# EasyEDA Pro project Pros_touch_weight_sensor-v1.0.0-2023-4-8.eprj, board PWS1
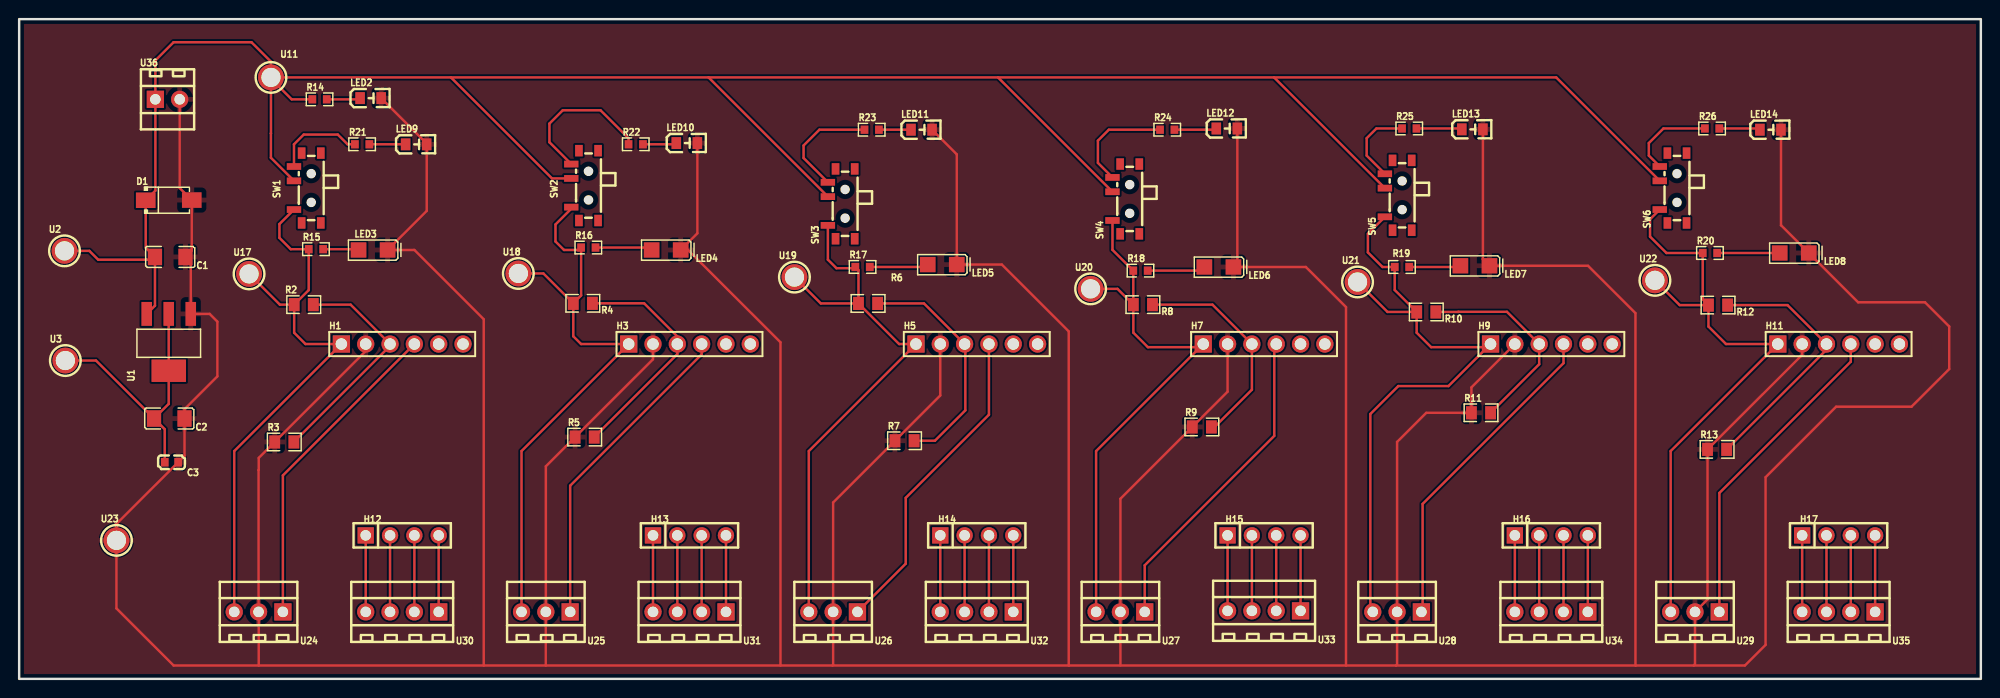
[diagram p1: board, top side]
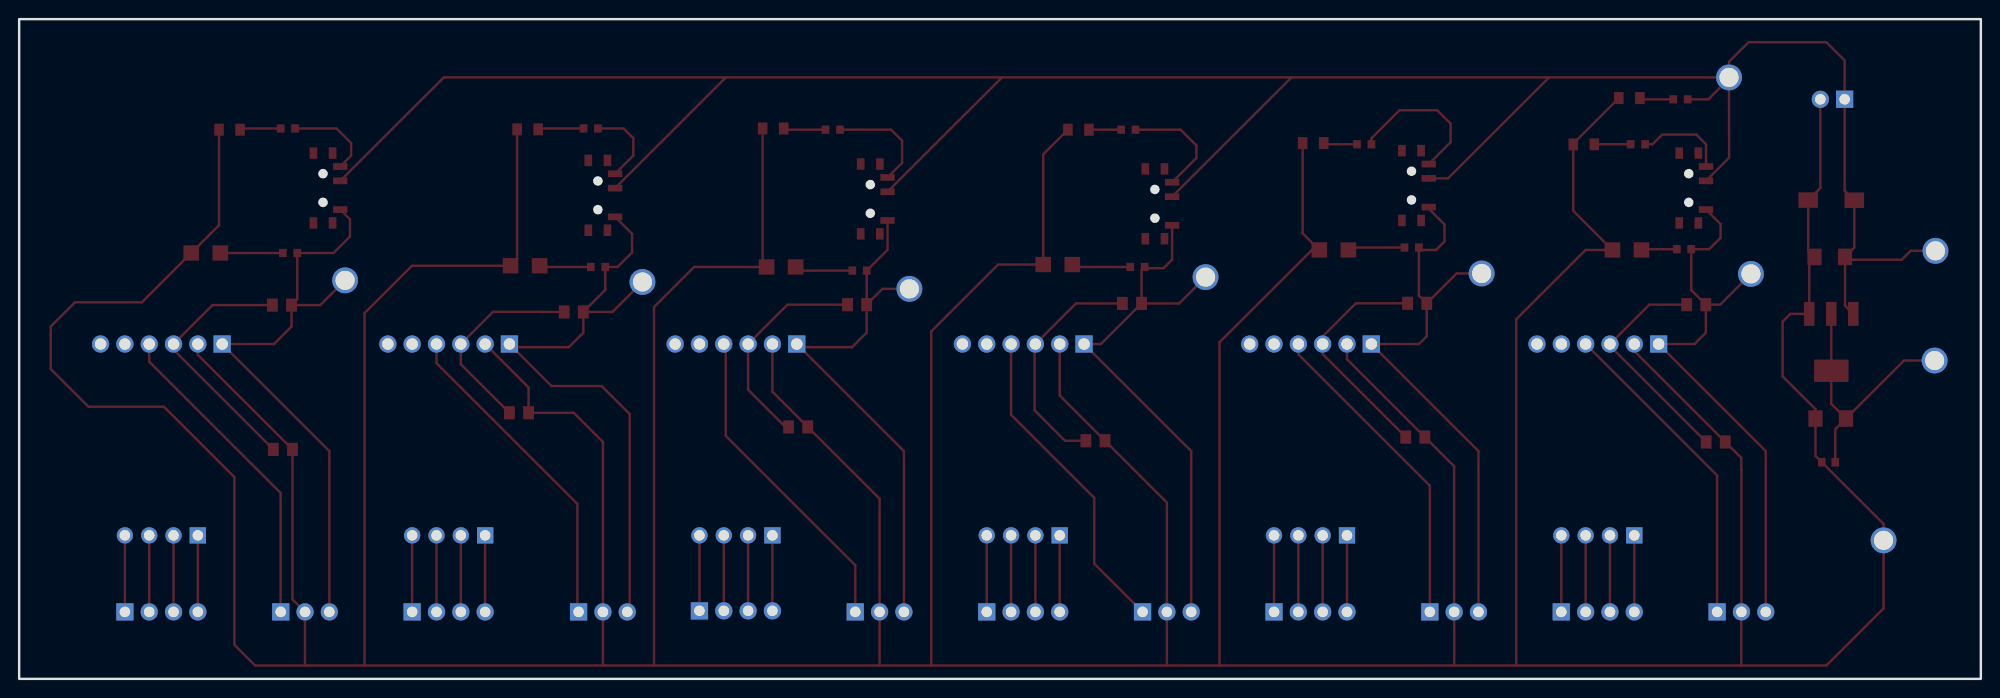
[diagram p2: board, bottom side, seen from below]

Outline 204.85 x 68.96 mm; copper layers: Top Layer, Bottom Layer. Coordinates in mm from the lower left corner of the outline.
Outline path: rectangle 0,68.96 204.85,0
Stack: Top Layer 0.035mm / Dielectric1 1.51mm FR4 er 4.5 / Bottom Layer 0.035mm

## Design rules (mm)
template: JLCPCB Capability(Two Layers Board)
spacing copperThickness1oz (default): track to track 0.102, other pairs 0.152 to 0.3
spacing copperThickness2oz: track to track 0.203, other pairs 0.152 to 0.3
track width copperThickness1oz (default): min 0.127, default 0.254, max 2.54
track width copperThickness2oz: min 0.203, default 0.254, max 2.54
differential pair differentialPair (default): width min 0.127, default 0.254, max 2.54; gap min 0.152, default 0.152
via viaSize (default): diameter min 0.5, default 0.61, max 10; hole min 0.3, default 0.305, max 6.3

## Placement (name value [footprint] x y rotation side)
C1  47uF  [C1206]  15.78 44.11 180 top
C2  47uF  [C1206]  15.68 27.21 180 top
C3  100nF  [C0603]  15.9 22.64 180 top
D1  SMAJ5.0A  [SMA_L4.3-W2.6-LS5.0-RD]  15.62 50.04 0 top
H1  2.54-1x6P直针  [HDR-TH_6P-P2.54-V-M-1]  40 35 0 top
H3  2.54-1x6P直针  [HDR-TH_6P-P2.54-V-M-1]  70 35 0 top
H5  2.54-1x6P直针  [HDR-TH_6P-P2.54-V-M-1]  100 35 0 top
H7  2.54-1x6P直针  [HDR-TH_6P-P2.54-V-M-1]  130 35 0 top
H9  2.54-1x6P直针  [HDR-TH_6P-P2.54-V-M-1]  160 35 0 top
H11  2.54-1x6P直针  [HDR-TH_6P-P2.54-V-M-1]  190 35 0 top
H12  B-2100S04P-A110  [HDR-TH_4P-P2.54-V-M]  40 15 0 top
H13  B-2100S04P-A110  [HDR-TH_4P-P2.54-V-M]  70 15 0 top
H14  B-2100S04P-A110  [HDR-TH_4P-P2.54-V-M]  100 15 0 top
H15  B-2100S04P-A110  [HDR-TH_4P-P2.54-V-M]  130 15 0 top
H16  B-2100S04P-A110  [HDR-TH_4P-P2.54-V-M]  160 15 0 top
H17  B-2100S04P-A110  [HDR-TH_4P-P2.54-V-M]  190 15 0 top
LED2  NCD0805B2  [LED0805-RD]  36.7 60.71 0 top
LED3  NCD1206G1  [LED1206-RD]  36.96 44.83 180 top
LED4  NCD1206G1  [LED1206-RD]  67.56 44.83 180 top
LED5  NCD1206G1  [LED1206-RD]  96.39 43.31 180 top
LED6  NCD1206G1  [LED1206-RD]  125.28 43.05 180 top
LED7  NCD1206G1  [LED1206-RD]  152.02 43.18 180 top
LED8  NCD1206G1  [LED1206-RD]  185.36 44.52 180 top
LED9  NCD0805B2  [LED0805-RD]  41.46 55.87 0 top
LED10  NCD0805B2  [LED0805-RD]  69.72 56.01 0 top
LED11  NCD0805B2  [LED0805-RD]  94.23 57.4 0 top
LED12  NCD0805B2  [LED0805-RD]  126.11 57.53 0 top
LED13  NCD0805B2  [LED0805-RD]  151.75 57.44 0 top
LED14  NCD0805B2  [LED0805-RD]  182.88 57.4 0 top
R2  1kΩ  [R0805]  29.72 39.12 180 top
R3  1kΩ  [R0805]  27.69 24.77 0 top
R4  1kΩ  [R0805]  58.86 39.26 180 top
R5  1kΩ  [R0805]  59.06 25.27 0 top
R6  1kΩ  [R0805]  88.65 39.24 180 top
R7  1kΩ  [R0805]  92.46 24.89 0 top
R8  1kΩ  [R0805]  117.35 39.12 180 top
R9  1kΩ  [R0805]  123.51 26.33 0 top
R10  1kΩ  [R0805]  146.94 38.35 180 top
R11  1kΩ  [R0805]  152.65 27.81 0 top
R12  1kΩ  [R0805]  177.41 39.07 180 top
R13  1kΩ  [R0805]  177.31 23.99 0 top
R14  1kΩ  [R0603]  31.37 60.58 0 top
R15  1kΩ  [R0603]  30.99 44.91 0 top
R16  1kΩ  [R0603]  59.44 45.08 0 top
R17  1kΩ  [R0603]  88.07 43.05 0 top
R18  1kΩ  [R0603]  117.09 42.67 0 top
R19  1kΩ  [R0603]  144.4 43.05 0 top
R20  1kΩ  [R0603]  176.56 44.52 0 top
R21  1kΩ  [R0603]  35.81 55.88 0 top
R22  1kΩ  [R0603]  64.39 55.88 0 top
R23  1kΩ  [R0603]  89.03 57.4 0 top
R24  1kΩ  [R0603]  119.89 57.4 0 top
R25  1kΩ  [R0603]  145.16 57.53 0 top
R26  1kΩ  [R0603]  176.78 57.53 0 top
SW1  PCM12SMTR  [SW-SMD_PCM12SMTR]  30.1 51.31 90 top
SW2  PCM12SMTR  [SW-SMD_PCM12SMTR]  59.06 51.56 90 top
SW3  PCM12SMTR  [SW-SMD_PCM12SMTR]  85.85 49.66 90 top
SW4  PCM12SMTR  [SW-SMD_PCM12SMTR]  115.57 50.17 90 top
SW5  PCM12SMTR  [SW-SMD_PCM12SMTR]  144.02 50.55 90 top
SW6  PCM12SMTR  [SW-SMD_PCM12SMTR]  172.72 51.31 90 top
U1  AMS1117-3.3  [SOT-223-3_L6.5-W3.4-P2.30-LS7.0-BR]  15.62 35.18 90 top
U2  5010  [TESTPOINT-TH_BD3.2]  4.74 44.74 0 top
U3  5010  [TESTPOINT-TH_BD3.2]  4.83 33.27 0 top
U11  5010  [TESTPOINT-TH_BD3.2]  26.3 62.87 0 top
U17  5010  [TESTPOINT-TH_BD3.2]  24.01 42.33 0 top
U18  5010  [TESTPOINT-TH_BD3.2]  52.13 42.38 0 top
U19  5010  [TESTPOINT-TH_BD3.2]  80.96 42 0 top
U20  5010  [TESTPOINT-TH_BD3.2]  111.89 40.77 0 top
U21  5010  [TESTPOINT-TH_BD3.2]  139.76 41.49 0 top
U22  5010  [TESTPOINT-TH_BD3.2]  170.81 41.66 0 top
U23  5010  [TESTPOINT-TH_BD3.2]  10.16 14.48 0 top
U24  DB125-2.54-3P-GN-S  [CONN-TH_DB125-2.54-3P-GN]  25 7 180 top
U25  DB125-2.54-3P-GN-S  [CONN-TH_DB125-2.54-3P-GN]  55 7 180 top
U26  DB125-2.54-3P-GN-S  [CONN-TH_DB125-2.54-3P-GN]  85 7 180 top
U27  DB125-2.54-3P-GN-S  [CONN-TH_DB125-2.54-3P-GN]  115 7 180 top
U28  DB125-2.54-3P-GN-S  [CONN-TH_DB125-2.54-3P-GN]  143.89 7 180 top
U29  DB125-2.54-3P-GN-S  [CONN-TH_DB125-2.54-3P-GN]  175 7 180 top
U30  DB125-2.54-4P-GN-S  [CONN-TH_DB125-2.54-4P-GN]  40 7 180 top
U31  DB125-2.54-4P-GN-S  [CONN-TH_DB125-2.54-4P-GN]  70 7 180 top
U32  DB125-2.54-4P-GN-S  [CONN-TH_DB125-2.54-4P-GN]  100 7 180 top
U33  DB125-2.54-4P-GN-S  [CONN-TH_DB125-2.54-4P-GN]  130 7.11 180 top
U34  DB125-2.54-4P-GN-S  [CONN-TH_DB125-2.54-4P-GN]  160 7 180 top
U35  DB125-2.54-4P-GN-S  [CONN-TH_DB125-2.54-4P-GN]  190 7 180 top
U36  DB125-2.54-2P-GN-S  [CONN-TH_DB125-2.54-2P-GN]  15.49 60.58 0 top

## Footprints (pads in the part's own frame, mm; a bottom-side part is the same pattern mirrored in y, then rotated)
C0603
  rect 0.8x0.9 smd: 1(-0.7,0) 2(0.7,0)
C1206
  rect 1.485x1.728 smd: 1(-1.593,0) 2(1.593,0)
CONN-TH_DB125-2.54-2P-GN
  rect 1.8x1.8 hole 1.1: 1(-1.27,0)
  round 1.8 hole 1.1: 2(1.27,0)
CONN-TH_DB125-2.54-3P-GN
  rect 1.8x1.8 hole 1.1: 1(-2.54,0)
  round 1.8 hole 1.1: 2(0,0) 3(2.54,0)
CONN-TH_DB125-2.54-4P-GN
  rect 1.8x1.8 hole 1.1: 1(-3.81,0)
  round 1.8 hole 1.1: 2(-1.27,0) 3(1.27,0) 4(3.81,0)
HDR-TH_4P-P2.54-V-M
  rect 1.7x1.7 hole 1.1: 1(-3.81,0)
  round 1.7 hole 1.1: 2(-1.27,0) 3(1.27,0) 4(3.81,0)
HDR-TH_6P-P2.54-V-M-1
  rect 1.8x1.8 hole 1.2: 1(-6.35,0)
  round 1.8 hole 1.2: 2(-3.81,0) 3(-1.27,0) 4(1.27,0) 5(3.81,0) 6(6.35,0)
LED0805-RD
  rect 1x1.25 smd: 1(-1.1,0) 2(1.1,0)
LED1206-RD
  rect 1.635x1.6 smd: 1(-1.518,0) 2(1.518,0)
R0603
  rect 0.806x0.864 smd: 1(-0.753,0) 2(0.753,0)
R0805
  rect 1.133x1.377 smd: 1(-1,0) 2(1,0)
SMA_L4.3-W2.6-LS5.0-RD
  rect 2.046x1.62 smd: 1(-2.404,-0.009) 2(2.404,0.009)
SOT-223-3_L6.5-W3.4-P2.30-LS7.0-BR
  rect 2.5x1.1 smd: 1(2.97,-2.3) 2(2.97,0) 3(2.97,2.3)
  rect 2.34x3.6 smd: 4(-2.97,0)
SW-SMD_PCM12SMTR
  rect 0.7x1.5 smd: 1(-2.25,1.4) 2(0.75,1.4) 3(2.25,1.4)
  rect 1.2x0.8 smd: 4(-3.65,0.6) 4(-3.65,-1.4) 4(3.65,0.6) 4(3.65,-1.4)
TESTPOINT-TH_BD3.2
  round 2.7 hole 2: 1(0,0)

## Nets
3.3V: C2.2 C3.2 U1.2 U1.4 U3.1
5V: C1.2 D1.1 R14.1 SW1.2 SW2.2 SW3.2 SW4.2 SW5.2 SW6.2 U1.3 U2.1 U11.1 U36.1
GND: C1.1 C2.1 C3.1 D1.2 H1.2 H3.2 H5.2 H7.2 H9.2 H11.2 LED2.2 LED3.1 LED4.1 LED5.1 LED6.1 LED7.1 LED8.1 LED9.2 LED10.2 LED11.2 LED12.2 LED13.2 LED14.2 R3.1 R5.1 R7.1 R9.1 R11.1 R13.1 U1.1 U23.1 U24.2 U25.2 U26.2 U27.2 U28.2 U29.2 U36.2
GND1: H12.4 U30.1
VCC1: H12.1 U30.4
A1+: H1.4 U24.1
A1-: H1.3 R2.1 R3.2
A2+: H3.4 U25.1
A2-: H3.3 R4.1 R5.2
A3+: H5.4 U26.1
A3-: H5.3 R6.1 R7.2
A4+: H7.4 U27.1
A4-: H7.3 R8.1 R9.2
A5+: H9.4 U28.1
A5-: H9.3 R10.1 R11.2
A6+: H11.4 U29.1
A6-: H11.3 R12.1 R13.2
DT: H12.3 U30.2
E1+: H1.1 R2.2 R15.1 SW1.1 U17.1 U24.3
E2+: H3.1 R4.2 R16.1 SW2.1 U18.1 U25.3
E3+: H5.1 R6.2 R17.1 SW3.1 U19.1 U26.3
E4+: H7.1 R8.2 R18.1 SW4.1 U20.1 U27.3
E5+: H9.1 R10.2 R19.1 SW5.1 U21.1 U28.3
E6+: H11.1 R12.2 R20.1 SW6.1 U22.1 U29.3
SCK: H12.2 U30.3
$1N6996: LED2.1 R14.2
$1N8070: LED3.2 R15.2
$1N8106: LED4.2 R16.2
$1N8147: LED5.2 R17.2
$1N8185: LED6.2 R18.2
$1N8223: LED7.2 R19.2
$1N8261: LED8.2 R20.2
$1N8907: LED9.1 R21.2
$1N8986: LED10.1 R22.2
$1N9065: LED11.1 R23.2
$1N9144: LED12.1 R24.2
$1N9223: LED13.1 R25.2
$1N9302: LED14.1 R26.2
$1N9310: R21.1 SW1.3
$1N9314: R22.1 SW2.3
$1N9318: R23.1 SW3.3
$1N9322: R24.1 SW4.3
$1N9326: R25.1 SW5.3
$1N9330: R26.1 SW6.3
$1N10322: H13.1 U31.4
$1N10325: H13.2 U31.3
$1N10328: H13.3 U31.2
$1N10331: H13.4 U31.1
$1N10334: H14.1 U32.4
$1N10337: H14.2 U32.3
$1N10340: H14.3 U32.2
$1N10343: H14.4 U32.1
$1N10346: H15.1 U33.4
$1N10349: H15.2 U33.3
$1N10352: H15.3 U33.2
$1N10355: H15.4 U33.1
$1N10358: H16.1 U34.4
$1N10378: H16.2 U34.3
$1N10381: H16.3 U34.2
$1N10384: H16.4 U34.1
$1N10387: H17.1 U35.4
$1N10390: H17.2 U35.3
$1N10393: H17.3 U35.2
$1N10396: H17.4 U35.1

Pads without a net: H1 5 6; H3 5 6; H5 5 6; H7 5 6; H9 5 6; H11 5 6; SW1 4; SW2 4; SW3 4; SW4 4; SW5 4; SW6 4

## Routing (per net, layer and track width the routed paths; a pad name or vN(x,y) marks a point on that pad's centre or on a via; arc(x,y) is an arc through that point)
3.3V: length 28.4
  Top Layer w0.254: C2.2 8.02,33.27 U3.1 ; C2.2 15.62,28.75 U1.4 U1.2 ; C2.2 15.2,26.09 C3.2
5V: length 287.3
  Top Layer w0.254: SW2.2 55.64,52.31 45.08,62.87 ; 71.99,62.87 SW3.2 ; 71.99,62.87 45.08,62.87 ; 71.99,62.87 102.22,62.87 ; 26.3,62.74 U11.1 ; 26.3,62.74 28.46,60.58 R14.1 ; 26.3,62.74 26.3,57.03 26.29,57.02 26.29,54.47 SW1.2 ; U11.1 45.08,62.87 ; U11.1 26.3,64.51 24.26,66.55 16.13,66.55 14.22,64.64 U36.1 14.22,51.04 D1.1 13.22,45.07 C1.2 ; C1.2 14.18,39.01 U1.3 ; C1.2 13.89,43.81 8.26,43.81 7.33,44.74 U2.1 ; SW5.2 131.04,62.87 ; 131.04,62.87 102.22,62.87 ; 131.04,62.87 160.51,62.87 SW6.2 ; 102.22,62.87 SW4.2
GND: length 875.5
  Top Layer w0.254: 84.93,1.4 109.62,1.4 ; 84.93,1.4 85,1.46 U26.2 85,18.44 R7.1 96.19,29.63 H5.2 ; 84.93,1.4 79.5,1.4 ; 109.62,1.4 138.56,1.4 ; 109.62,1.4 109.6,1.42 109.6,36.32 102.62,43.31 LED5.1 97.91,54.83 LED11.2 ; 174.87,1.4 180.21,1.4 182.37,3.56 182.37,21.08 189.74,28.45 197.61,28.45 201.55,32.39 201.55,36.83 199.02,39.36 192.04,39.36 LED8.1 183.98,47.42 LED14.2 ; 174.87,1.4 175,1.53 U29.2 176.31,8.31 R13.1 186.19,33.87 H11.2 ; 174.87,1.4 168.79,1.4 ; 168.79,1.4 143.76,1.4 ; 168.79,1.4 168.78,1.41 168.78,38.23 163.83,43.18 LED7.1 152.85,43.86 LED13.2 ; 143.76,1.4 143.89,1.52 143.89,24.77 146.94,27.81 R11.1 151.65,30.46 H9.2 ; 143.76,1.4 138.56,1.4 ; 25.02,1.4 16.13,1.4 10.16,7.37 U23.1 10.16,16.2 C3.1 17.27,23.31 C2.1 17.27,28.19 20.7,31.62 20.7,37.34 19.89,38.15 U1.1 17.92,43.55 C1.1 18.03,44.76 D1.2 16.76,51.31 U36.2 ; 25.02,1.4 48.51,1.4 ; 25.02,1.4 25.02,6.98 ; 138.56,1.4 138.56,38.86 134.37,43.05 126.8,43.05 127.21,43.46 127.21,57.53 ; LED10.2 70.82,46.57 LED4.1 69.85,44.83 79.5,35.18 79.5,1.4 ; 25.4,7.4 25.02,7.02 25.02,6.98 ; 54.99,1.4 54.99,6.99 U25.2 55,22.22 R5.1 66.19,33.41 H3.2 ; 54.99,1.4 48.51,1.4 ; 54.99,1.4 79.5,1.4 ; 48.51,1.4 48.51,37.59 41.28,44.83 LED3.1 42.56,48.92 42.56,55.95 LED2.2 ; 25.02,6.98 U24.2 25,21.83 25.02,21.84 25.02,23.1 R3.1 36.19,34.27 H1.2 ; 115,1.4 U27.2 115,18.83 R9.1 126.19,30.02 H7.2
GND1: length 8
  Top Layer w0.254: H12.4 U30.1
VCC1: length 8
  Top Layer w0.254: H12.1 U30.4
A1+: length 33.7
  Top Layer w0.254: U24.1 27.54,21.27 H1.4
A1-: length 24.1
  Top Layer w0.254: R3.2 38.73,34.81 H1.3 34.61,39.12 R2.1
A2+: length 33.7
  Top Layer w0.254: U25.1 57.54,20.19 71.27,33.92 H3.4
A2-: length 24.4
  Top Layer w0.254: R5.2 68.73,33.95 H3.3 68.73,35.79 65.26,39.26 R4.1
A3+: length 33.7
  Top Layer w0.254: H5.4 101.27,27.61 92.58,18.92 92.58,12.04 U26.1
A3-: length 24.5
  Top Layer w0.254: R7.2 95.63,24.89 98.81,28.07 98.81,34.92 H5.3 94.49,39.24 R6.1
A4+: length 33.7
  Top Layer w0.254: H7.4 131.06,34.79 131.06,25.4 117.54,11.88 U27.1
A4-: length 22.7
  Top Layer w0.254: R9.2 124.84,26.33 128.73,30.23 H7.3 124.61,39.12 R8.1
A5+: length 34.7
  Top Layer w0.254: H9.4 161.27,33 146.56,18.29 146.56,6.6 146.43,6.48
A5-: length 21.5
  Top Layer w0.254: R10.1 150.27,38.35 150.29,38.37 155.36,38.37 H9.3 158.73,32.89 R11.2
A6+: length 33.7
  Top Layer w0.254: H11.4 191.27,33.16 177.55,19.43 177.55,7.01 U29.1
A6-: length 27.3
  Top Layer w0.254: R12.1 184.66,39.07 H11.3 188.73,34.41 R13.2
DT: length 8
  Top Layer w0.254: H12.3 U30.2
E1+: length 60.6
  Top Layer w0.254: SW1.1 27.18,47.54 27.18,46.1 28.37,44.91 R15.1 30.24,40.64 R2.2 ; U17.1 27.22,39.12 R2.2 ; U24.3 22.46,23.81 H1.1 29.9,35 28.72,36.18 R2.2
E2+: length 62.8
  Top Layer w0.254: U25.3 52.46,23.81 H3.1 58.68,35 57.86,35.81 R4.2 ; SW2.1 57.66,49.15 56.01,47.5 56.01,45.72 56.9,44.83 58.43,44.83 R16.1 58.68,40.08 R4.2 ; R4.2 54.74,42.38 U18.1
E3+: length 59
  Top Layer w0.254: R6.2 87.65,42.73 R17.1 87.19,42.93 85.34,42.93 84.45,43.82 SW3.1 ; R6.2 91.89,35 H5.1 82.46,23.81 U26.3 ; R6.2 83.71,39.24 U19.1
E4+: length 58
  Top Layer w0.254: 123.32,34.67 117.87,34.67 116.35,36.19 R8.2 116.34,39.12 ; 123.32,34.67 H7.1 ; 123.32,34.67 112.46,23.81 U27.3 ; 116.34,39.12 R18.1 114.17,44.84 SW4.1 ; 116.34,39.12 114.7,40.77 U20.1
E5+: length 68.1
  Top Layer w0.254: 153.32,34.67 147.45,34.67 145.94,36.18 R10.2 ; 153.32,34.67 149.26,30.61 144.02,30.61 141.1,27.69 141.1,6.73 141.35,6.48 ; 153.32,34.67 H9.1 ; R10.2 142.89,38.35 U21.1 ; R10.2 143.65,40.65 R19.1 142.37,43.05 140.84,44.58 140.84,46.52 SW5.1
E6+: length 64.7
  Top Layer w0.254: R12.2 173.4,39.07 U22.1 ; R12.2 176.41,36.83 178.24,35 H11.1 172.46,23.81 U29.3 ; R12.2 175.81,39.67 R20.1 172.02,44.52 170.31,46.23 170.31,48.05 SW6.1
SCK: length 8
  Top Layer w0.254: H12.2 U30.3
$1N6996: length 3.5
  Top Layer w0.254: R14.2 35.48,60.58 LED2.1
$1N8070: length 3.7
  Top Layer w0.254: R15.2 35.36,44.91 LED3.2
$1N8106: length 6
  Top Layer w0.254: LED4.2 65.79,45.08 R16.2
$1N8147: length 6.2
  Top Layer w0.254: LED5.2 94.62,43.05 R17.2
$1N8185: length 6.1
  Top Layer w0.254: LED6.2 123.38,42.67 R18.2
$1N8223: length 5.4
  Top Layer w0.254: R19.2 150.37,43.05 LED7.2
$1N8261: length 6.5
  Top Layer w0.254: R20.2 LED8.2
$1N8907: length 3.8
  Top Layer w0.254: 40.36,55.87 40.35,55.88 R21.2
$1N8986: length 3.5
  Top Layer w0.254: LED10.1 68.5,55.88 R22.2
$1N9065: length 3.4
  Top Layer w0.254: R23.2 LED11.1
$1N9144: length 4.4
  Top Layer w0.254: LED12.1 124.88,57.4 R24.2
$1N9223: length 4.8
  Top Layer w0.254: R25.2 150.56,57.53 LED13.1
$1N9302: length 4.3
  Top Layer w0.254: LED14.1 181.65,57.53 R26.2
$1N9310: length 9.5
  Top Layer w0.254: R21.1 34.29,55.88 33.27,56.9 29.72,56.9 28.7,55.88 SW1.3
$1N9314: length 15.9
  Top Layer w0.254: SW2.3 55.37,56.09 55.37,58.04 56.77,59.44 60.71,59.44 63.64,56.51 R22.1
$1N9318: length 11.9
  Top Layer w0.254: R23.1 83.57,57.4 81.91,55.75 81.91,54.44 SW3.3
$1N9322: length 11.4
  Top Layer w0.254: SW4.3 112.65,53.94 112.65,56.26 113.79,57.4 R24.1
$1N9326: length 8.6
  Top Layer w0.254: SW5.3 140.72,54.7 140.72,56.52 141.73,57.53 R25.1
$1N9330: length 9.4
  Top Layer w0.254: SW6.3 170.18,54.7 170.18,56.01 171.7,57.53 R26.1
$1N10322: length 8
  Top Layer w0.254: H13.1 U31.4
$1N10325: length 8
  Top Layer w0.254: H13.2 U31.3
$1N10328: length 8
  Top Layer w0.254: H13.3 U31.2
$1N10331: length 8
  Top Layer w0.254: H13.4 U31.1
$1N10334: length 8
  Top Layer w0.254: H14.1 U32.4
$1N10337: length 8
  Top Layer w0.254: H14.2 U32.3
$1N10340: length 8
  Top Layer w0.254: H14.3 U32.2
$1N10343: length 8
  Top Layer w0.254: H14.4 U32.1
$1N10346: length 7.9
  Top Layer w0.254: H15.1 U33.4
$1N10349: length 7.9
  Top Layer w0.254: H15.2 U33.3
$1N10352: length 7.9
  Top Layer w0.254: H15.3 U33.2
$1N10355: length 7.9
  Top Layer w0.254: H15.4 U33.1
$1N10358: length 8
  Top Layer w0.254: H16.1 U34.4
$1N10378: length 8
  Top Layer w0.254: H16.2 U34.3
$1N10381: length 8
  Top Layer w0.254: H16.3 U34.2
$1N10384: length 8
  Top Layer w0.254: 163.82,15 H16.4 U34.1
$1N10387: length 8
  Top Layer w0.254: H17.1 U35.4
$1N10390: length 8
  Top Layer w0.254: H17.2 U35.3
$1N10393: length 8
  Top Layer w0.254: H17.3 U35.2
$1N10396: length 8
  Top Layer w0.254: H17.4 U35.1

## Copper pours and planes (outline as drawn; the poured copper is in the pictures)
GND on Top Layer: -0.63,70.74 207.14,70.74 207.14,-0.89 -0.63,-0.89
